# EAGLE design amplifier (EAGLE 6.4)
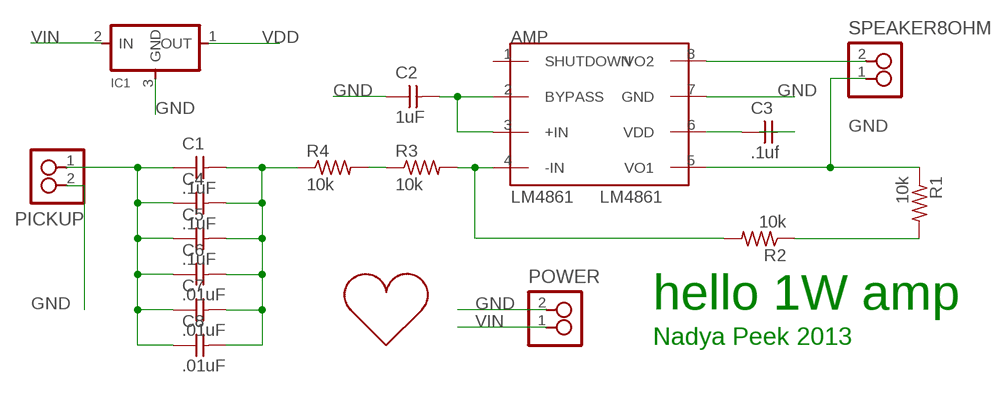
[diagram p0: schematic, sheet 1]

## Parts
AMP  LM4861  [SOIC8]
C1  .1uF  UNPOLARIZED_CAPACITOR1206  [1206]
C2  1uF  UNPOLARIZED_CAPACITOR1206  [1206]
C3  .1uf  UNPOLARIZED_CAPACITOR1206  [1206]
C4  .1uF  UNPOLARIZED_CAPACITOR1206  [1206]
C5  .1uF  UNPOLARIZED_CAPACITOR1206  [1206]
C6  .01uF  UNPOLARIZED_CAPACITOR1206  [1206]
C7  .01uF  UNPOLARIZED_CAPACITOR1206  [1206]
C8  .01uF  UNPOLARIZED_CAPACITOR1206  [1206]
IC1  REGULATORSOT23  [SOT23]
PICKUP  2_PIN_HEADERSCREW  [SCREW_2]
POWER  2_PIN_HEADERSCREW  [SCREW_2]
R1  10k  RESISTOR1206  [1206]
R2  10k  RESISTOR1206  [1206]
R3  10k  RESISTOR1206  [1206]
R4  10k  RESISTOR1206  [1206]
SPEAKER8OHM  2_PIN_HEADERSCREW  [SCREW_2]
U$2  SMALLHEARTSMALL  [SMALLERHEART]

## Nets
GND: AMP.7(GND) C2.1 C3.2 IC1.3(GND) PICKUP.2 POWER.2
N$1: AMP.4(-IN) R2.2 R3.2
N$2: R3.1 R4.2
N$3: AMP.2(BYPASS) AMP.3(+IN) C2.2
N$5: AMP.5(VO1) R1.1 SPEAKER8OHM.1
N$6: R1.2 R2.1
N$7: C1.2 C4.2 C5.2 C6.2 C7.2 C8.2 R4.1
N$9: C1.1 C4.1 C5.1 C6.1 C7.1 C8.1 PICKUP.1
SPEAKER: AMP.8(VO2) SPEAKER8OHM.2
VDD: AMP.6(VDD) C3.1 IC1.1(OUT)
VIN: IC1.2(IN) POWER.1
Unconnected: AMP.1(SHUTDOWN)

## Notes on the sheet
- hello 1W amp
- Nadya Peek 2013

## Library data of the parts
AMP = nadya:LM4861
C1-C8 = ng:UNPOLARIZED_CAPACITOR: unpolarized_capacitor
IC1 = ng:REGULATOR
PICKUP POWER SPEAKER8OHM = ng:2_PIN_HEADER: 2 SMT pin pads
R1-R4 = ng:RESISTOR
U$2 = heart:SMALLHEART

## Board
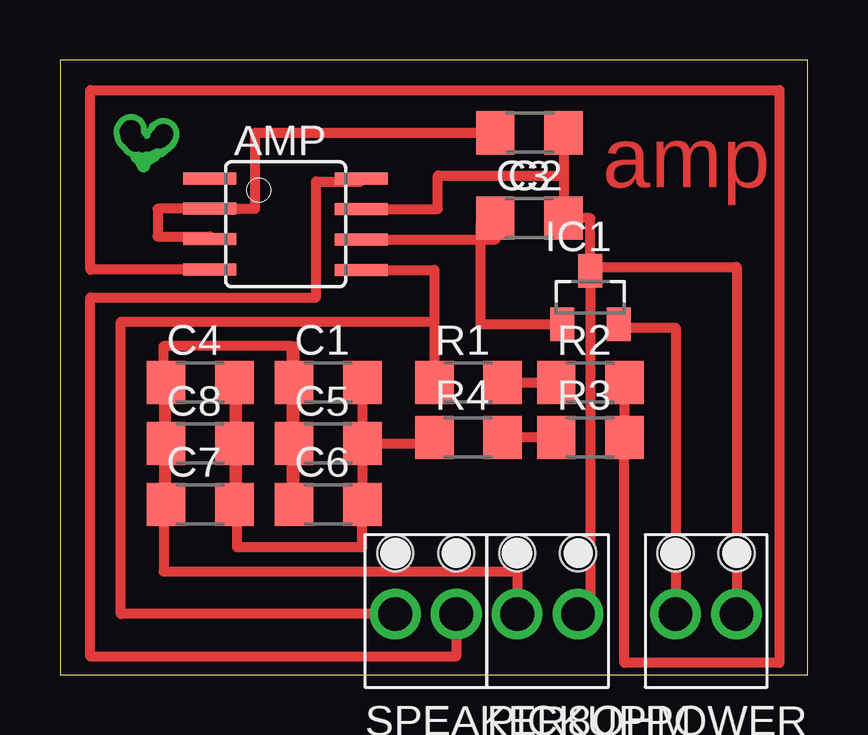
[diagram p1: board, top side]

Size 31.17 x 25.64 mm. Coordinates in mm from the lower left corner, seen from the top.
Outline: 0,0 31.17,0 31.17,25.64 0,25.64 0,0
Copper layers (1*16): Top 0.035mm / dielectric 1.5mm / Bottom 0.035mm
Design rules "default": minimum track width 10mil, minimum drill 24mil, track to track 8mil, track to pad 8mil, pad to pad 8mil, via to via 8mil, smd to smd 8mil, copper to edge 40mil, drill to drill 8mil, minimum pad ring 10mil, minimum via ring 8mil, stop-mask expansion 4mil, vias tented up to drill 0mil, thermal gap 10mil

### Footprints (pad centres in the part's own frame; a part is rotated, then mirrored left to right if it is on the bottom)
SOIC8 = smd 0.5 x 2.2: 1 -1.905,-3.154; 2 -0.645,-3.154; 3 0.625,-3.154; 4 1.895,-3.154; 5 1.905,3.154; 6 0.635,3.154; 7 -0.635,3.154; 8 -1.905,3.154
1206 = smd 1.6 x 1.803: 1 -1.422,0; 2 1.422,0
SOT23 = smd 1 x 1.4: 1 -1.179,-1.125; 2 1.179,-1.125; 3 0,1.1
SCREW_2 = drill 1.4 pad 2.108: 1 -1.27,-1.27; 2 1.27,-1.27 | hole 1.5: 1.27,1.27; -1.27,1.27
SMALLERHEART = drill 0.8: P$1 1.132,1.736; P$2 1.117,1.82; P$3 1.155,1.645; P$4 1.384,1.392; P$5 1.254,1.537; P$6 1.178,1.905; P$7 2.379,1.545; P$8 2.486,1.614; P$9 2.532,1.729 | drill 0.5: P$10 2.501,1.645; P$11 2.379,1.53; P$12 2.188,1.392; P$13 1.92,1.254; P$14 2.034,1.331; P$15 1.645,1.224; P$16 1.866,1.254; P$17 1.201,1.897; P$18 1.262,1.805; P$19 1.384,1.629 | drill 0: P$20 1.392,1.645; P$21 1.392,1.499; P$22 1.216,1.453; P$23 1.094,1.239; P$24 1.797,1.262; P$25 2.012,1.163; P$26 1.943,1.4; P$27 1.415,0.772; P$28 1.637,0.604; P$29 1.621,0.535; P$30 1.698,0.39; P$31 1.82,0.597; P$32 1.92,0.688; P$33 2.119,0.818; P$34 2.211,0.918; P$35 2.264,0.971; P$36 2.172,1.981; P$37 2.723,1.323; P$38 2.57,1.14; P$39 2.654,1.201; P$40 2.486,1.079; P$41 2.409,1.01

### Placement (x,y rotation side)
AMP  9.4,18.8 270 top
C1  11.18,12.19 0 top
C2  19.56,22.61 180 top
C3  19.56,19.05 0 top
C4  5.84,12.19 0 top
C5  11.18,9.65 0 top
C6  11.18,7.11 0 top
C7  5.84,7.11 0 top
C8  5.84,9.65 0 top
IC1  22.1,15.75 0 top
PICKUP  20.32,3.81 0 top
POWER  26.92,3.81 0 top
R1  17.02,12.19 0 top
R2  22.1,12.19 0 top
R3  22.1,9.91 0 top
R4  17.02,9.91 0 top
SPEAKER8OHM  15.24,3.81 0 top
U$2  1.78,20.83 0 top

### Tracks (layer width: path | path; a pad name or v marks a point on that pad's centre or on a via)
GND
  Top 0.406: AMP.7 15.75,19.43 15.75,20.83 20.98,20.83 | 20.98,20.83 C3.2 22.1,19.05 22.1,17.02 | C2.1 20.98,20.83 | 22.1,17.02 IC1.3 22.1,2.79 21.59,2.79 PICKUP.2 | 22.1,17.02 28.19,17.02 POWER.2
N$1
  Top 0.406: R2.2 R3.2 23.52,0.51 29.97,0.51 29.97,24.38 1.27,24.38 1.27,16.9 AMP.4
N$2
  Top 0.406: R3.1 R4.2
N$3
  Top 0.406: AMP.3 6.24,18.29 4.06,18.29 4.06,19.44 AMP.2 8.13,19.44 8.13,22.61 C2.2
N$5
  Top 0.406: AMP.5 15.6,16.89 R1.1 15.6,14.73 2.54,14.73 2.54,2.54 SPEAKER8OHM.1
N$6
  Top 0.406: R1.2 R2.1
N$7
  Top 0.406: C5.2 C6.2 12.6,5.33 7.37,5.33 7.37,12.19 C4.2 C8.2 C7.2 | C1.2 C5.2 | C5.2 15.6,9.65 R4.1
N$9
  Top 0.406: 4.32,12.19 C4.1 C8.1 C7.1 | 4.32,12.19 4.32,13.72 9.65,13.72 | 9.65,13.72 9.75,13.72 C1.1 C5.1 C6.1 9.65,7.11 9.65,13.72 | 4.32,12.19 4.32,4.32 19.05,4.32 PICKUP.1
SPEAKER
  Top 0.406: AMP.8 12.55,20.57 10.67,20.57 10.67,15.75 1.27,15.75 1.27,0.76 16.51,0.76 SPEAKER8OHM.2
VDD
  Top 0.406: AMP.6 18.14,18.16 C3.1 18.14,18.8 17.53,18.8 17.53,14.62 IC1.1
VIN
  Top 0.406: IC1.2 23.28,14.48 25.65,14.48 POWER.1

### Text on the board
Top: amp